# Altium schematic sheet Noise_Sheet1.SchDoc
size A4
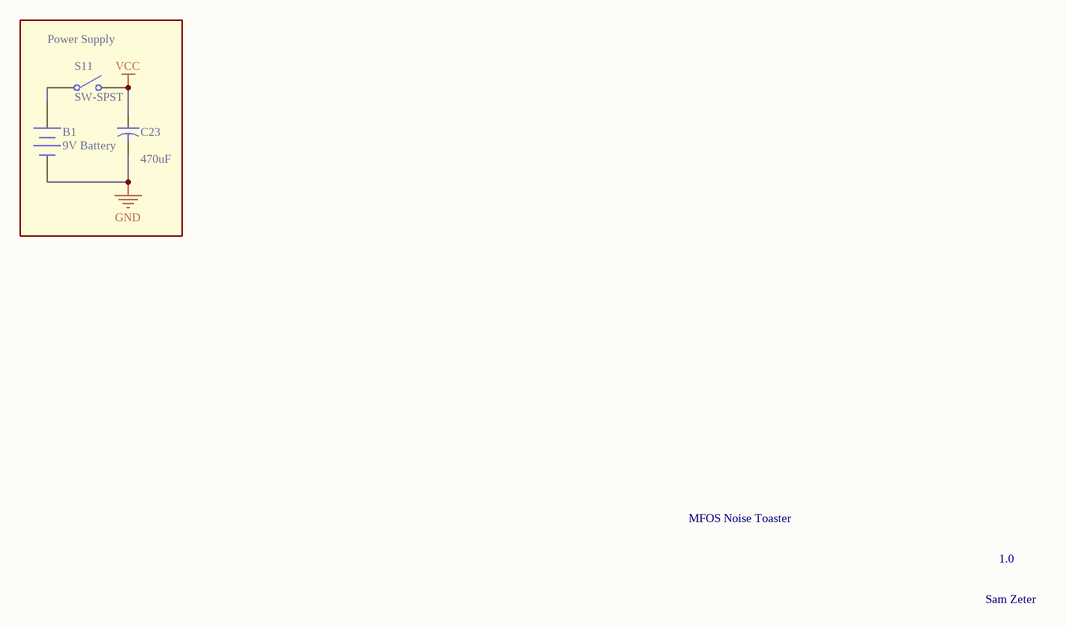
[diagram p0: Noise_Sheet1.SchDoc]

## Parts
B1  9V Battery  [BAT-2]
C23  value 470uF  [CAPR5-4X5]  (hidden comment: Cap2)
S11  SW-SPST  [SPST-2]

## Blocks framed on the sheet
Power Supply: B1 C23 S11

## Nets
GND: B1.2(-) C23.2
VCC: C23.1 S11.2(NO)
NetB1_1: B1.1(+) S11.1(COMMON)

## Notes on the sheet
- MFOS Noise Toaster
- 1.0
- Sam Zeter

## Library data of the parts
B1 = Battery: Multicell Battery; Published: 24-Mar-1999; LatestRevisionDate: 17-Jul-2002; LatestRevisionNote: Re-released for DXP Platform.; PackageReference: BAT-2; Publisher: Altium Limited; PackageDescription: Battery; 2 Leads
C23 = Cap2: Capacitor; Published: 23-Sep-2002; PackageReference: CAPR5-4X5; Publisher: Altium Limited; PackageDescription: Capacitor; 2 Leads
S11 = SW-SPST: Single-Pole, Single-Throw Switch; Published: 24-Mar-1999; LatestRevisionDate: 17-Jul-2002; LatestRevisionNote: Re-released for DXP Platform.; PackageReference: SPST-2; Publisher: Altium Limited; PackageDescription: Switch; 2 Leads